# Altium schematic sheet 电源.SchDoc
size A4
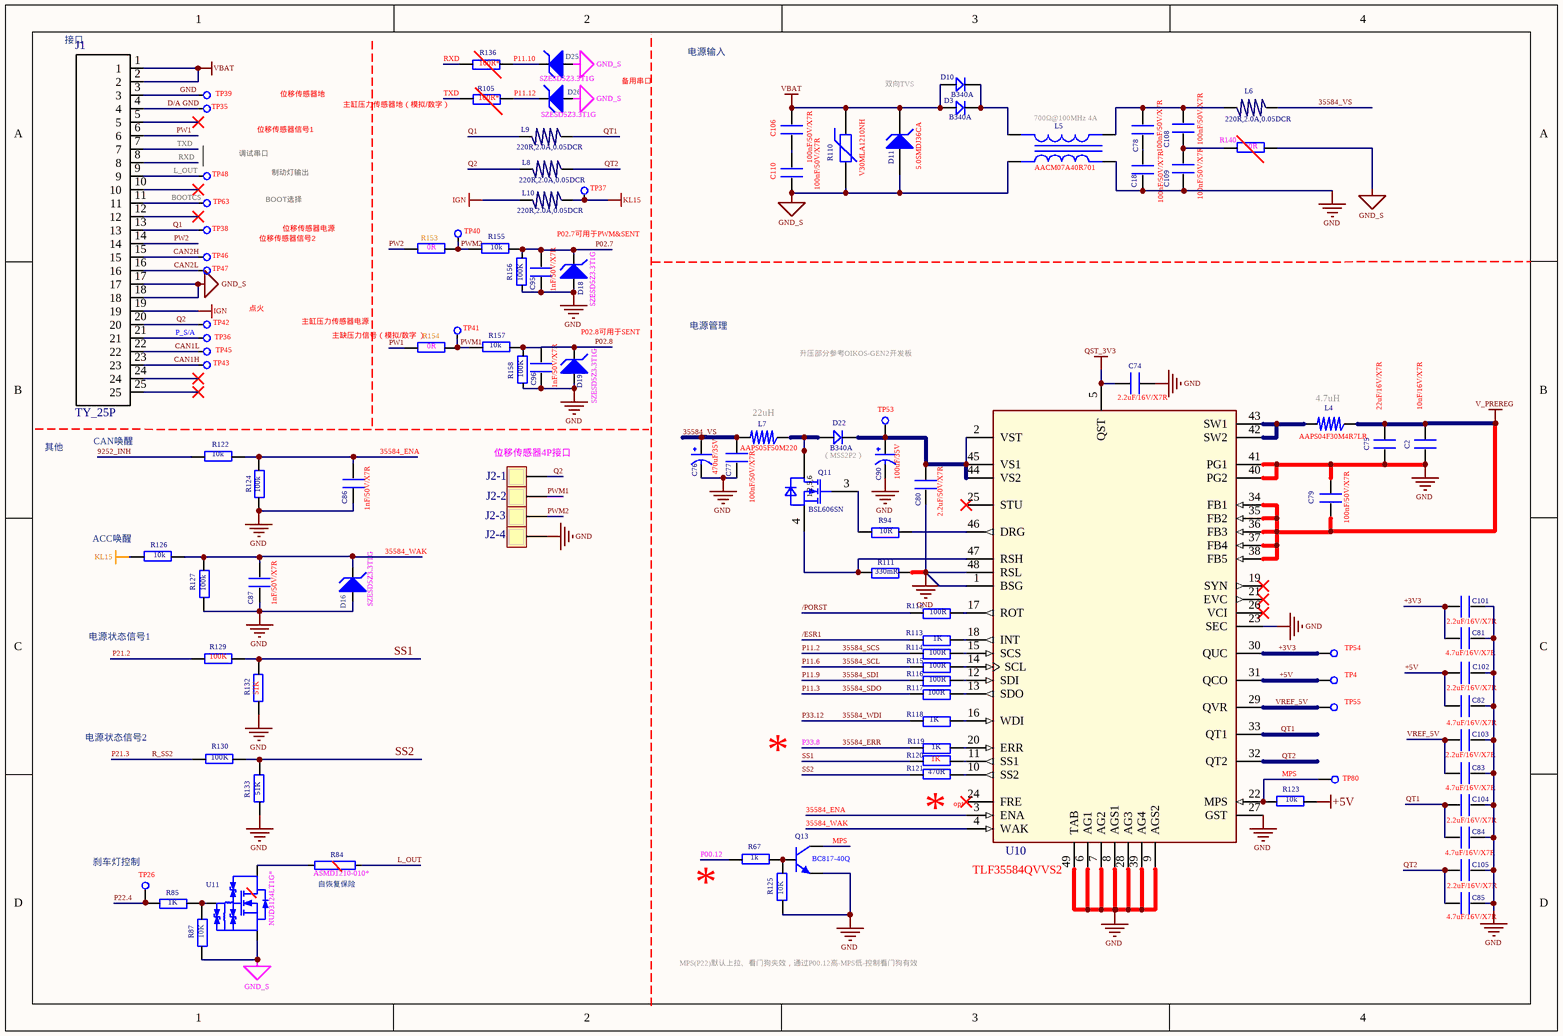
[diagram p0: 电源.SchDoc]

## Parts
C2  10uF/16V/X7R  [C1206]
C18  100nF/50V/X7R  [0805]
C74  2.2uF/16V/X7R  [C0603P]
C75  22uF/16V/X7R  [C1206]
C76  470uF/35V  [CM F(10*10.2)]
C77  100nF/50V/X7R  [C0603P]
C78  100nF/50V/X7R  [0805]
C79  100nF/50V/X7R  [C0603P]
C80  2.2uF/50V/X7R  [C0805]
C81  4.7uF/16V/X7R  [C0805]
C82  4.7uF/16V/X7R  [C0805]
C83  4.7uF/16V/X7R  [C0805]
C84  4.7uF/16V/X7R  [C0805]
C85  4.7uF/16V/X7R  [C0805]
C86  1nF/50V/X7R  [C0603P]
C87  1nF/50V/X7R  [C0603P]
C90  100uF/35V  [AL-6.3*5.8]
C95  1nF/50V/X7R  [C0603P]
C96  1nF/50V/X7R  [C0603P]
C101  2.2uF/16V/X7R  [C0603P]
C102  2.2uF/16V/X7R  [C0603P]
C103  2.2uF/16V/X7R  [C0603P]
C104  2.2uF/16V/X7R  [C0603P]
C105  2.2uF/16V/X7R  [C0603P]
C106  100nF/50V/X7R  [0805]
C108  100nF/50V/X7R  [C0805]
C109  100nF/50V/X7R  [C0805]
C110  100nF/50V/X7R  [0805]
D3  B340A  [DO-214AC]
D10  B340A  [DO-214AC]
D11  5.0SMDJ36CA  [SMC_L6.9-W5.9-LS7.9-RD]
D16  SZESD5Z3.3T1G  [SOD-523F]
D18  SZESD5Z3.3T1G  [SOD-523F]
D19  SZESD5Z3.3T1G  [SOD-523F]
D22  B340A  [DO-214AC]
D25  SZESD5Z3.3T1G  [SOD-523F]
D26  SZESD5Z3.3T1G  [SOD-523F]
J1  TY_25P  [TY421011]
J2-1  pad  [焊盘]  (value not drawn)
J2-2  pad  [焊盘]  (value not drawn)
J2-3  pad  [焊盘]  (value not drawn)
J2-4  pad  [焊盘]  (value not drawn)
L4  AAPS04F30M4R7LR  [IND-SMD_L4.0-W4.0]
L5  AACM07A40R701  [FILTER-SMD_4P-L7.0-W6.0-BL]
L6  220R,2.0A,0.05DCR  [0603P]
L7  AAPS05F50M220  [IND-SMD_L5.0-W5.0]
L8  220R,2.0A,0.05DCR  [0603P]
L9  220R,2.0A,0.05DCR  [0603P]
L10  220R,2.0A,0.05DCR  [0603P]
Q11  BSL606SN  [SOP95P250X110-6N]
Q13  BC817-40Q  [SOT-23N]
R67  1k  [0603P]
R84  ASMD1210-010*  [1210G]
R85  1K  [0603P]
R87  10K  [0603P]
R94  10R  [0603P]
R105  100R*  [0603P]
R110  V30MLA1210NH  [1210G]
R111  330mR  [R2512]
R112  100R  [0603P]
R113  1K  [0603P]
R114  100R  [0603P]
R115  100R  [0603P]
R116  100R  [0603P]
R117  100R  [0603P]
R118  1K  [0603P]
R119  1K  [0603P]
R120  1K  [0603P]
R121  470R  [0603P]
R122  10k  [0603P]
R123  10k  [0603P]
R124  100k  [0603P]
R125  10K  [0603P]
R126  10k  [0603P]
R127  100k  [0603P]
R129  100K  [0603P]
R130  100K  [0603P]
R132  51K  [0603P]
R133  51K  [0603P]
R136  100R*  [0603P]
R140  *0R  [0603P]
R153  0R  [0603P]
R154  0R  [0603P]
R155  10k  [0603P]
R156  100K  [0603P]
R157  10k  [0603P]
R158  100K  [0603P]
TP4  测试点  [测试点]  (value not drawn)
TP26  测试点  [测试点]  (value not drawn)
TP35  测试点  [测试点]  (value not drawn)
TP36  测试点  [测试点]  (value not drawn)
TP37  测试点  [测试点]  (value not drawn)
TP38  测试点  [测试点]  (value not drawn)
TP39  测试点  [测试点]  (value not drawn)
TP40  测试点  [测试点]  (value not drawn)
TP41  测试点  [测试点]  (value not drawn)
TP42  测试点  [测试点]  (value not drawn)
TP43  测试点  [测试点]  (value not drawn)
TP45  测试点  [测试点]  (value not drawn)
TP46  测试点  [测试点]  (value not drawn)
TP47  测试点  [测试点]  (value not drawn)
TP48  测试点  [测试点]  (value not drawn)
TP53  测试点  [测试点]  (value not drawn)
TP54  测试点  [测试点]  (value not drawn)
TP55  测试点  [测试点]  (value not drawn)
TP63  测试点  [测试点]  (value not drawn)
TP80  测试点  [测试点]  (value not drawn)
U10  TLF35584QVVS2  [QFN50P700X700X90-49N-3-1]
U11  NUD3124LT1G*  [SOT-23-NUD3124]

## Nets
+5V: C82.2 C102.2 R123.1 TP4.1 U10.31(QCO)
GND: C2.1 C18.1 C74.1 C75.1 C76.2(GND) C77.1 C79.2 C80.1 C81.1 C82.1 C83.1 C84.1 C85.1 C86.1 C87.1 C90.2(GND) C95.1 C96.1 C101.1 C102.1 C103.1 C104.1 C105.1 C109.1 D16.2(A) D18.2(A) D19.2(A) J1.3 J2-4.1 L5.4(Pri-) Q13.3(E) R111.1 R124.1 R125.2 R127.1 R132.2 R133.2 R156.2 R158.2 TP39.1 U10.1(BSG) U10.6(AG1) U10.7(AG2) U10.8(AGS1) U10.9(AGS2) U10.23(SEC) U10.27(GST) U10.28(AG3) U10.39(AG4) U10.40(PG2) U10.41(PG1) U10.48(RSL) U10.49(TAB)
GND_S: C110.1 D11.2(K) D25.2(A) D26.2(A) J1.17 J1.18 L5.1(Pri+) R87.1 R110.2 R140.1 U11.2(S)
IGN: J1.19 L10.2
KL15: L10.1 R126.2 TP37.1
QST_3V3: C74.2 U10.5(QST)
V_PREREG: C2.2 C75.2 C79.1 L4.1 U10.34(FB1) U10.35(FB2) U10.36(FB3) U10.37(FB4) U10.38(FB5)
VBAT: C106.2 D3.1 D10.1 D11.1(A) J1.1 J1.2 R110.1
9252_INH: R122.2
35584_ENA: C86.2 R122.1 R124.2 U10.3(ENA)
35584_ERR: R119.1  [also labelled P33.8]
35584_SCL: R115.1  [also labelled P11.6]
35584_SCS: R114.1  [also labelled P11.2]
35584_SDI: R116.1  [also labelled P11.9]
35584_SDO: R117.1  [also labelled P11.3]
35584_VS: C76.1(VCC) C77.2 L6.1 L7.2
35584_WAK: C87.2 D16.1(K) R126.1 R127.2 U10.4(WAK)
35584_WDI: R118.1  [also labelled P33.12]
+3V3: C81.2 C101.2 TP54.1 U10.30(QUC)
/ESR1: R113.1
/PORST: R112.1
BOOTCS: J1.11 TP63.1
CAN1H: J1.23 TP43.1
CAN1L: J1.22 TP45.1
CAN2H: J1.15 TP46.1
CAN2L: J1.16 TP47.1
D/A GND: J1.4 TP35.1
L_OUT: J1.9 R84.2 TP48.1
MPS: Q13.2(C) R123.2 TP80.1 U10.22(MPS)
P00.12: R67.2
P02.7: C95.2 D18.1(K) R155.1 R156.1
P02.8: C96.2 D19.1(K) R157.1 R158.1
P11.10: D25.1(K) R136.2
P11.12: D26.1(K) R105.2
P21.2: R129.2
P21.3: R130.2  [also labelled R_SS2]
P22.4: R85.1 TP26.1
P_S/A: J1.21 TP36.1
PW1: J1.6 R154.2
PW2: J1.14 R153.2
PWM1: J2-2.1 R154.1 R157.2 TP41.1
PWM2: J2-3.1 R153.1 R155.2 TP40.1
Q1: J1.13 L9.2 TP38.1
Q2: J1.20 J2-1.1 L8.2 TP42.1
QT1: C84.2 C104.2 L9.1 U10.33(QT1)
QT2: C85.2 C105.2 L8.1 U10.32(QT2)
RXD: J1.8 R136.1
SS1: R120.2 R129.1 R132.1
SS2: R121.2 R130.1 R133.1
TXD: J1.7 R105.1
VREF_5V: C83.2 C103.2 TP55.1 U10.29(QVR)
NetC18_2: C18.2 C78.1
NetC78_2: C78.2 C108.2 L5.3(Sec-) L6.2
NetC80_2: C80.2 C90.1(VCC) D22.2 TP53.1 U10.2(VST) U10.44(VS2) U10.45(VS1)
NetC106_1: C106.1 C110.2
NetC108_1: C108.1 C109.2 R140.2
NetD3_2: D3.2 D10.2 L5.2(Sec+)
NetD22_1: D22.1 L7.1 Q11.1(DRAIN) Q11.2(DRAIN) Q11.5(DRAIN) Q11.6(DRAIN)
NetL4_2: L4.2 U10.42(SW2) U10.43(SW1)
NetQ11_3: Q11.3(GATE) R94.1
NetQ11_4: Q11.4(SOURCE) R111.2 U10.47(RSH)
NetQ13_1: Q13.1(B) R67.1 R125.1
NetR84_1: R84.1 U11.3(D)
NetR85_2: R85.2 R87.2 U11.1(G)
NetR94_2: R94.2 U10.46(DRG)
NetR112_2: R112.2 U10.17(ROT)
NetR113_2: R113.2 U10.18(INT)
NetR114_2: R114.2 U10.15(SCS)
NetR115_2: R115.2 U10.14(SCL)
NetR116_2: R116.2 U10.12(SDI)
NetR117_2: R117.2 U10.13(SDO)
NetR118_2: R118.2 U10.16(WDI)
NetR119_2: R119.2 U10.20(ERR)
NetR120_1: R120.1 U10.11(SS1)
NetR121_1: R121.1 U10.10(SS2)

Not connected (* = marked no-connect by the designer): J1 5* 10* 12* 24* 25*; U10 19(SYN)* 21(EVC)* 24(FRE)* 25(STU)* 26(VCI)*

## Notes on the sheet
- 接口
- 位移传感器地
- 主缸压力传感器地（模拟/数字）
- 备用串口
- 电源输入
- 双向TVS
- (near TP48) 调试串口
- 位移传感器信号1
- 制动灯输出
- (near L5) 700Ω@100MHz 4A
- 位移传感器信号2
- BOOT选择
- 位移传感器电源
- P02.7可用于PWM&SENT
- 点火
- 主缸压力传感器电源
- 主缺压力信号（模拟/数字 ）
- (near D19) P02.8可用于SENT
- 电源管理
- 升压部分参考OIKOS-GEN2开发板
- 其他
- (near J1) CAN唤醒
- (near L7) 22uH
- (near L4) 4.7uH
- (near J2-1) 位移传感器4P接口
- （MSS2P2）
- (near R126) ACC唤醒
- 电源状态信号1
- 电源状态信号2
- *
- (near R121) *
- opt
- 刹车灯控制
- (near R84) 自恢复保险
- (near R67) *
- MPS(P22)默认上拉、看门狗失效，通过P00.12高-MPS低-控制看门狗有效
- (in symbol BSL606SN) 1,2,5,6

## Library data of the parts
C2 C18 C74 C75 C77-C87 C95 C96 C101-C106 C108-C110 = C
C76 C90 = CAP
D3 D10 D22 = D
D11 D16 D18 D19 D25 D26 = D Zener: Zener Diode; Published: 8-Jun-2000; LatestRevisionDate: 17-Jul-2002; LatestRevisionNote: Re-released for DXP Platform.; PackageReference: DIODE-0.7; Publisher: Altium Limited; PackageDescription: Diode, Thru-Hole; 2 Leads; 0.7 in Pin Spacing
J2-1-J2-4 = pad: 单焊盘
L4 L7 = L_SOP
L5 = ACT45B-510-2P
L6 L8-L10 = L
Q11 = BSL606SN: Insulated-Gate Field-Effect Transistor (IGFET), N-Channel, Enhancement, Body Diode, Pin 1 Drain, 2 Drain, 3 Gate, 4 Source, 5 Drain, 6 Drain, 6 Pins; Manufacturer: Infineon Technologies; ManufacturerPartNumber: BSL606SN; PackageReference: PG-TSOP6-6-6
Q13 = M_NPN: 贴片三极管
R67 R85 R87 R94 R105 R111-R127 R129 R130 R132 R133 R136 R140 R153-R158 = R
R84 = RES2: 自恢复保险
R110 = Res Varistor: Varistor (Voltage-Sensitive Resistor); Published: 24-Mar-1999; LatestRevisionDate: 29-May-2009; LatestRevisionNote: IPC-7351 Footprint Added.; PackageVersion: Mar-2003; PackageReference: 6-0805; Publisher: Altium Limited; PackageDescription: Chip Resistor 0805 Case Size; Code_IPC: RESC2012
U10 = TLF35584QVVS1: Multi Voltage Safety Micro Processor Supply (5.0 V Variant); Manufacturer: Infineon Technologies; ManufacturerPartNumber: TLF35584QVVS1; PackageReference: PG-VQFN-48
U11 = NUD3124: 集成驱动器